# EAGLE schematic psas_c3 (EAGLE 7.3.0)
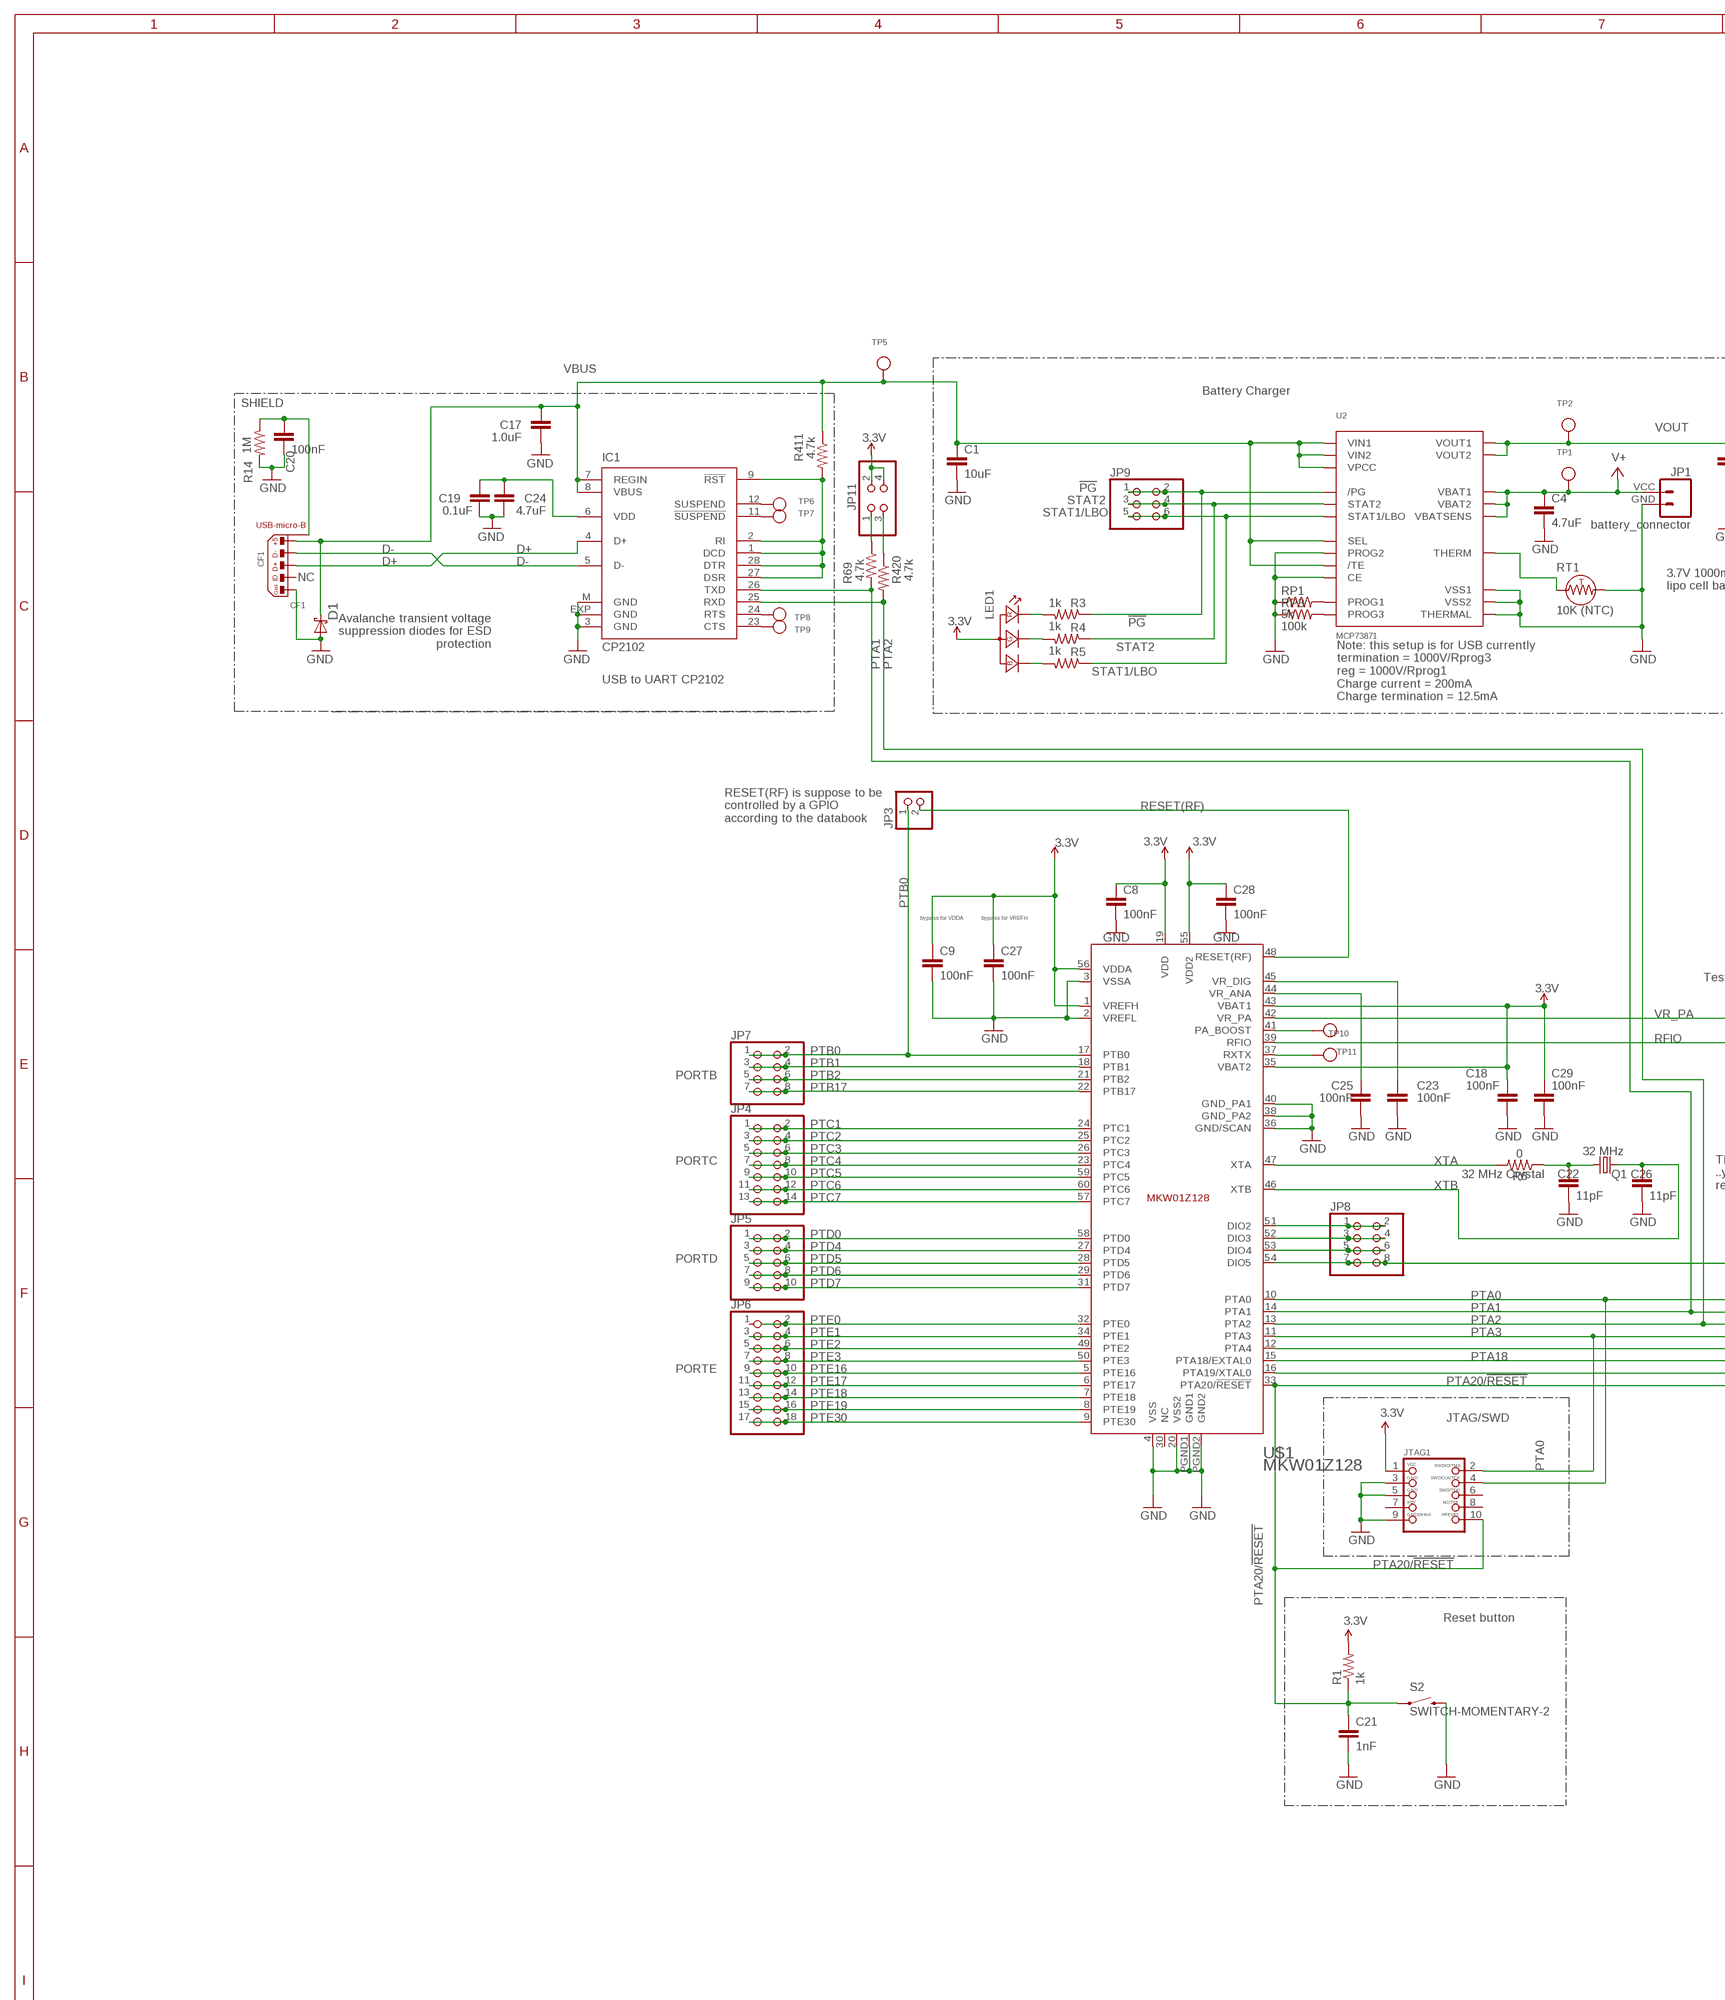
[diagram p0: schematic, sheet 1, part 1 of 2]
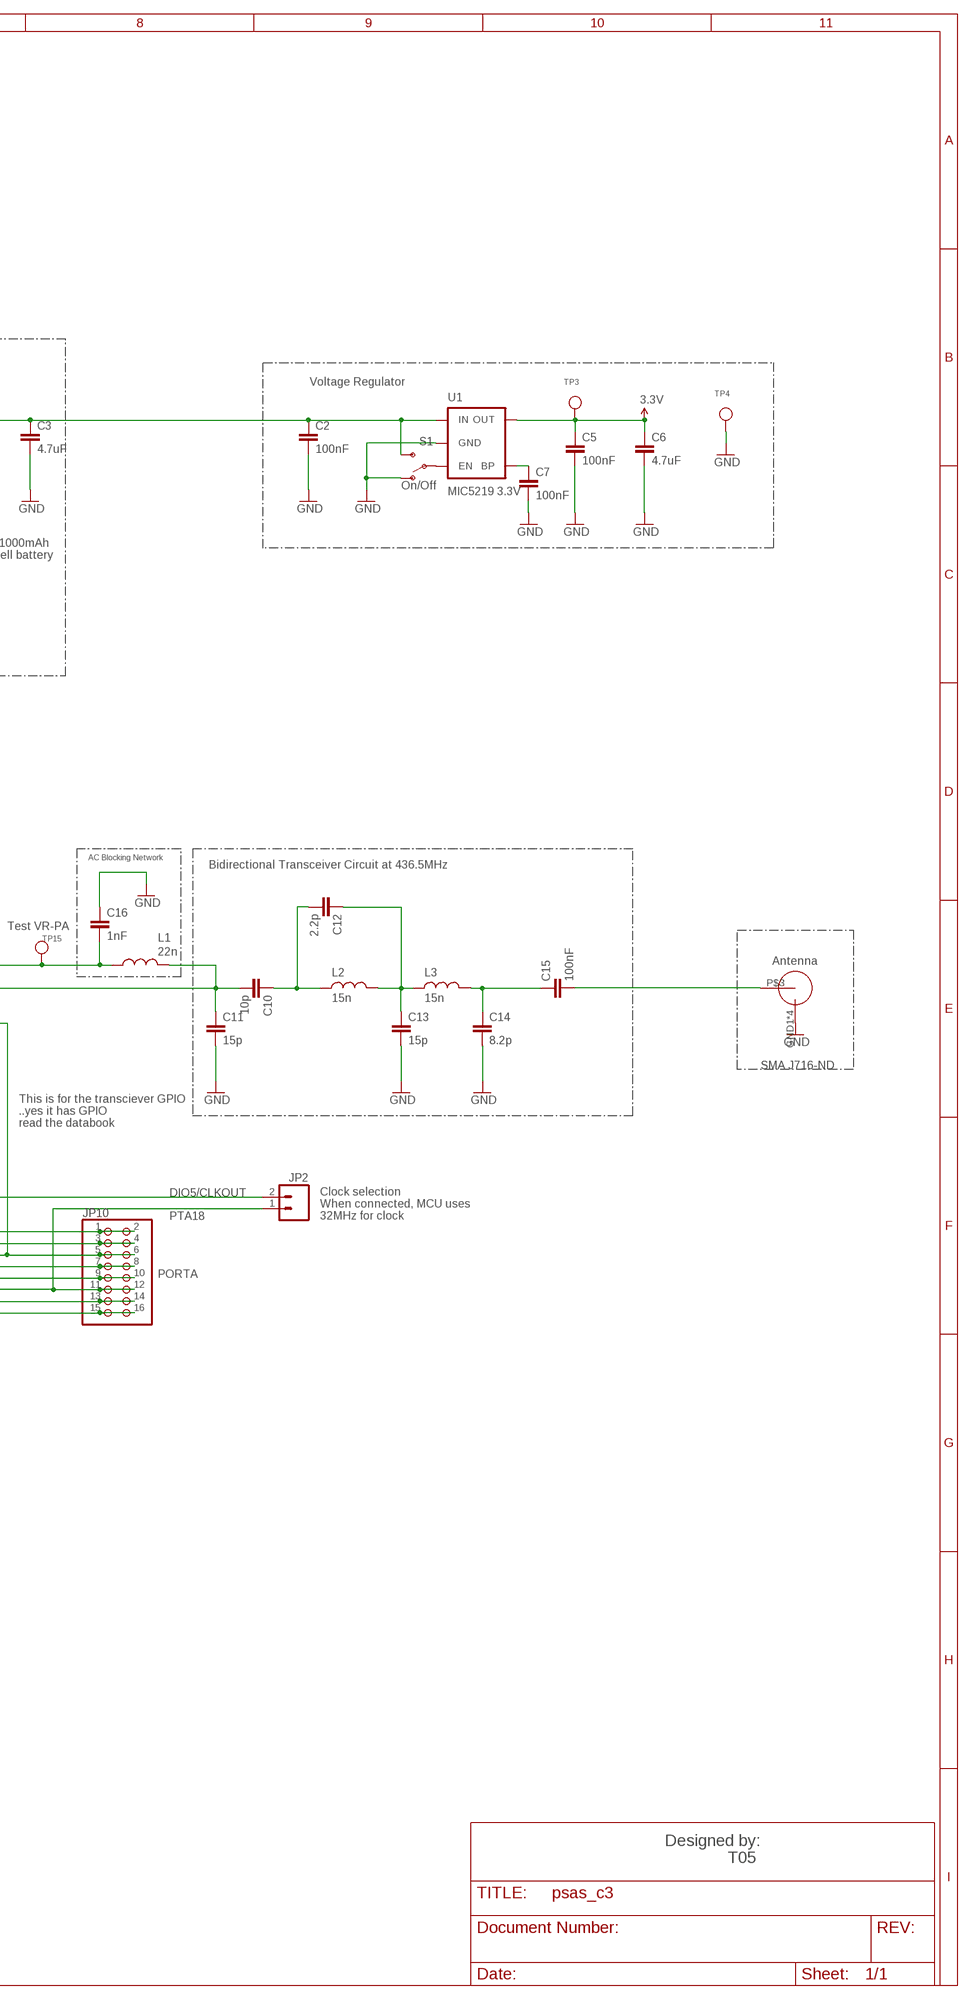
[diagram p1: schematic, sheet 1, part 2 of 2]

## Parts
C1  10uF  C-EU0603-B-NOSILK  [.0603-B-NOSILK]
C2  100nF  C-EU0603-B-NOSILK  [.0603-B-NOSILK]
C3  4.7uF  C-EU0603-B-NOSILK  [.0603-B-NOSILK]
C4  4.7uF  C-EU0603-B-NOSILK  [.0603-B-NOSILK]
C5  100nF  C-EU0603-B-NOSILK  [.0603-B-NOSILK]
C6  4.7uF  C-EU0603-B-NOSILK  [.0603-B-NOSILK]
C7  100nF  C-EU0603-B-NOSILK  [.0603-B-NOSILK]
C8  100nF  C-EU0603-B-NOSILK  [.0603-B-NOSILK]
C9  100nF  C-EU0603-B-NOSILK  [.0603-B-NOSILK]
C10  10p  C-EU0603-B-NOSILK  [.0603-B-NOSILK]
C11  15p  C-EU0603-B-NOSILK  [.0603-B-NOSILK]
C12  2.2p  C-EU0603-B-NOSILK  [.0603-B-NOSILK]
C13  15p  C-EU0603-B-NOSILK  [.0603-B-NOSILK]
C14  8.2p  C-EU0603-B-NOSILK  [.0603-B-NOSILK]
C15  100nF  C-EU0603-B-NOSILK  [.0603-B-NOSILK]
C16  1nF  C-EU0603-B-NOSILK  [.0603-B-NOSILK]
C17  1.0uF  C-EU0603-B-NOSILK  [.0603-B-NOSILK]
C18  100nF  C-EU0603-B-NOSILK  [.0603-B-NOSILK]
C19  0.1uF  C-EU0603-B-NOSILK  [.0603-B-NOSILK]
C20  100nF  C-EU0603-B-NOSILK  [.0603-B-NOSILK]
C21  1nF  C-EU0603-B-NOSILK  [.0603-B-NOSILK]
C22  11pF  C-EU0603-B-NOSILK  [.0603-B-NOSILK]
C23  100nF  C-EU0603-B-NOSILK  [.0603-B-NOSILK]
C24  4.7uF  C-EU0603-B-NOSILK  [.0603-B-NOSILK]
C25  100nF  C-EU0603-B-NOSILK  [.0603-B-NOSILK]
C26  11pF  C-EU0603-B-NOSILK  [.0603-B-NOSILK]
C27  100nF  C-EU0603-B-NOSILK  [.0603-B-NOSILK]
C28  100nF  C-EU0603-B-NOSILK  [.0603-B-NOSILK]
C29  100nF  C-EU0603-B-NOSILK  [.0603-B-NOSILK]
CF1  CF1  CON_USB-MICRO-B-RECEPTACLE-PTH-HIROSE-ZX62D-B-5P8  [USB-MICRO-B-PTH-HIROSE]
D1  DIODE_SCHOTTKY_1N5819  [SOD-123]
IC1  CP2102  [MLP28]
JP1  battery_connector  SPARKFUN-CONNECTORS_M024UCON-15767  [SPARKFUN-CONNECTORS_JST-2-SMD-VERT]
JP2  M02PTH  [1X02]
JP3  PINHD-1X2  [1X02]
JP4  PINHD-2X7  [2X07]
JP5  PINHD-2X5  [2X05]
JP6  PINHD-2X9  [2X09]
JP7  PINHD-2X4  [2X04]
JP8  PINHD-2X4  [2X04]
JP9  PINHD-2X3  [2X03]
JP10  PINHD-2X8  [2X08]
JP11  PINHD-2X2  [2X02]
JTAG1  JTAG-CORTEXM3MOLEX  [CORTEXM3_SWD10_MOLEX]
L1  22n  L-US0603-B-NOSILK  [.0603-B-NOSILK]
L2  15n  L-US0603-B-NOSILK  [.0603-B-NOSILK]
L3  15n  L-US0603-B-NOSILK  [.0603-B-NOSILK]
LED1  LED_RGB_COMMON_ANODE-1.6X1.26  [KINGBRITE_RGBLED_1.6X1.26]
Q1  32 MHz  FC-12M  [FC-12M]
R1  1k  R-US_0603-B-NOSILK  [.0603-B-NOSILK]
R3  1k  R-US_0603-B-NOSILK  [.0603-B-NOSILK]
R4  1k  R-US_0603-B-NOSILK  [.0603-B-NOSILK]
R5  1k  R-US_0603-B-NOSILK  [.0603-B-NOSILK]
R6  0  R-US_0603-B-NOSILK  [.0603-B-NOSILK]
R14  1M  R-US_0603-B-NOSILK  [.0603-B-NOSILK]
R69  4.7k  R-US_0603-B-NOSILK  [.0603-B-NOSILK]
R411  4.7k  R-US_0603-B-NOSILK  [.0603-B-NOSILK]
R420  4.7k  R-US_0603-B-NOSILK  [.0603-B-NOSILK]
RP1  5k  R-US_0603-B-NOSILK  [.0603-B-NOSILK]
RP3  100k  R-US_0603-B-NOSILK  [.0603-B-NOSILK]
RT1  10K (NTC)  THERMISTOR-_1206  [R1206]
S1  SWITCH-SPSTPTH  [SWITCH-SPDT]
S2  SWITCH-MOMENTARY-2  [TACTILE_SWITCH_TALL]
TP1  TESTPOINTROUND0.5MM  [TESTPOINT_ROUND_0.5MM]
TP2  TESTPOINTROUND0.5MM  [TESTPOINT_ROUND_0.5MM]
TP3  TESTPOINTROUND0.5MM  [TESTPOINT_ROUND_0.5MM]
TP4  TESTPOINTROUND0.5MM  [TESTPOINT_ROUND_0.5MM]
TP5  TESTPOINTROUND0.5MM  [TESTPOINT_ROUND_0.5MM]
TP6  TESTPOINTROUND0.5MM  [TESTPOINT_ROUND_0.5MM]
TP7  TESTPOINTROUND0.5MM  [TESTPOINT_ROUND_0.5MM]
TP8  TESTPOINTROUND0.5MM  [TESTPOINT_ROUND_0.5MM]
TP9  TESTPOINTROUND0.5MM  [TESTPOINT_ROUND_0.5MM]
TP10  TESTPOINTROUND0.5MM  [TESTPOINT_ROUND_0.5MM]
TP11  TESTPOINTROUND0.5MM  [TESTPOINT_ROUND_0.5MM]
TP15  TESTPOINTROUND0.5MM  [TESTPOINT_ROUND_0.5MM]
U1  MIC5219 3.3V  SPARKFUN-POWERIC_V_REG_MIC52193.3V  [SPARKFUN-POWERIC_SOT23-5]
U2  MCP73871  [QFN20_4MM]
U$1  MKW01Z128  [MKW01Z128]
U$2  SMAJ716-ND  [SMAJ716-ND]

## Nets
3.3V: C5.1 C6.1 C8.1 C9.1 C18.1 C27.1 C28.1 C29.1 JP11.2 JP11.4 JTAG1.1 LED1.2(COMMON_ANODE) R1.2 TP3.P$1 U1.5(OUT) U$1.1(VREFH) U$1.19(VDD) U$1.35(VBAT2) U$1.43(VBAT1) U$1.55(VDD2) U$1.56(VDDA)
!PG: JP9.1 JP9.2 R3.1 U2.P$6(/PG)
D+: CF1.3 IC1.4(D+)
D-: CF1.2 IC1.5(D-)
DIO5/CLKOUT: JP2.2 JP8.7 JP8.8 U$1.54(DIO5)
GND: C1.2 C2.2 C3.2 C4.2 C5.2 C6.2 C7.2 C8.2 C9.2 C11.2 C13.2 C14.2 C16.1 C17.2 C18.2 C19.2 C20.2 C21.2 C22.2 C23.2 C24.2 C25.2 C26.2 C27.2 C28.2 C29.2 CF1.5 D1.ANODE IC1.3(GND) IC1.EXP(GND) IC1.M(GND) JP1.GND JTAG1.3 JTAG1.5 JTAG1.9 R14.2 RP1.1 RP3.1 RT1.2 S1.1(O) S2.B2 TP4.P$1 U1.2(GND) U2.P$4(PROG2) U2.P$10(VSS1) U2.P$11(VSS2) U2.P$17(CE) U2.P$21(THERMAL) U$1.2(VREFL) U$1.3(VSSA) U$1.4(VSS) U$1.20(VSS2) U$1.36(GND/SCAN) U$1.38(GND_PA2) U$1.40(GND_PA1) U$1.PGND1(GND1) U$1.PGND2(GND2) U$2.GND1(OUTERCONDUCTOR) U$2.GND2(OUTERCONDUCTOR) U$2.GND3(OUTERCONDUCTOR) U$2.GND4(OUTERCONDUCTOR)
N$1: C7.1 U1.4(BP)
N$2: LED1.3(RK) R3.2
N$3: LED1.4(GK) R4.2
N$4: LED1.1(BK) R5.2
N$5: IC1.12(SUSPEND) TP6.P$1
N$6: RT1.1 U2.P$5(THERM)
N$7: IC1.11(!SUSPEND) TP7.P$1
N$8: S1.2(P) U1.3(EN)
N$9: RP1.2 U2.P$13(PROG1)
N$10: RP3.2 U2.P$12(PROG3)
N$11: IC1.24(RTS) TP8.P$1
N$12: C22.1 Q1.2 R6.1
N$13: TP10.P$1 U$1.41(PA_BOOST)
N$14: C25.1 U$1.44(VR_ANA)
N$15: TP11.P$1 U$1.37(RXTX)
N$16: JP8.1 JP8.2 U$1.51(DIO2)
N$17: C12.1 C13.1 L2.2 L3.1
N$18: C10.1 C12.2 L2.1
N$19: C15.2 U$2.P$3(CENTERCONDUCTOR)
N$20: JP8.3 JP8.4 U$1.52(DIO3)
N$21: C14.1 C15.1 L3.2
N$22: C23.1 U$1.45(VR_DIG)
N$23: JP8.5 JP8.6 U$1.53(DIO4)
N$24: C19.1 C24.1 IC1.6(VDD)
N$25: IC1.23(CTS) TP9.P$1
N$26: JP10.9 JP10.10 U$1.12(PTA4)
N$27: JP10.13 JP10.14 U$1.16(PTA19/XTAL0)
N$28: JP11.1 R69.1
N$29: JP11.3 R420.1
N$30: IC1.1(DCD) IC1.2(RI) IC1.9(!RST) IC1.27(DSR) IC1.28(DTR) R411.2
N$34: C20.1 CF1.S1(SHIELD) CF1.S2(SHIELD) CF1.S3(SHIELD) CF1.S4(SHIELD) R14.1
PTA0: JP10.1 JP10.2 JTAG1.4 U$1.10(PTA0)
PTA1: IC1.26(TXD) JP10.3 JP10.4 R69.2 U$1.14(PTA1)
PTA2: IC1.25(RXD) JP10.5 JP10.6 R420.2 U$1.13(PTA2)
PTA3: JP10.7 JP10.8 JTAG1.2 U$1.11(PTA3)
PTA18: JP2.1 JP10.11 JP10.12 U$1.15(PTA18/EXTAL0)
PTA20/!RESET: C21.1 JP10.15 JP10.16 JTAG1.10 R1.1 S2.A2 U$1.33(PTA20/!RESET)
PTB0: JP3.1 JP7.1 JP7.2 U$1.17(PTB0)
PTB1: JP7.3 JP7.4 U$1.18(PTB1)
PTB2: JP7.5 JP7.6 U$1.21(PTB2)
PTB17: JP7.7 JP7.8 U$1.22(PTB17)
PTC1: JP4.1 JP4.2 U$1.24(PTC1)
PTC2: JP4.3 JP4.4 U$1.25(PTC2)
PTC3: JP4.5 JP4.6 U$1.26(PTC3)
PTC4: JP4.7 JP4.8 U$1.23(PTC4)
PTC5: JP4.9 JP4.10 U$1.59(PTC5)
PTC6: JP4.11 JP4.12 U$1.60(PTC6)
PTC7: JP4.13 JP4.14 U$1.57(PTC7)
PTD0: JP5.1 JP5.2 U$1.58(PTD0)
PTD4: JP5.3 JP5.4 U$1.27(PTD4)
PTD5: JP5.5 JP5.6 U$1.28(PTD5)
PTD6: JP5.7 JP5.8 U$1.29(PTD6)
PTD7: JP5.9 JP5.10 U$1.31(PTD7)
PTE0: JP6.2 U$1.32(PTE0)
PTE1: JP6.3 JP6.4 U$1.34(PTE1)
PTE2: JP6.5 JP6.6 U$1.49(PTE2)
PTE3: JP6.7 JP6.8 U$1.50(PTE3)
PTE16: JP6.9 JP6.10 U$1.5(PTE16)
PTE17: JP6.11 JP6.12 U$1.6(PTE17)
PTE18: JP6.13 JP6.14 U$1.7(PTE18)
PTE19: JP6.15 JP6.16 U$1.8(PTE19)
PTE30: JP6.17 JP6.18 U$1.9(PTE30)
RESET(RF): JP3.2 U$1.48(RESET(RF))
RFIO: C10.2 C11.1 L1.2 U$1.39(RFIO)
STAT1/LBO: JP9.5 JP9.6 R5.1 U2.P$8(STAT1/LBO)
STAT2: JP9.3 JP9.4 R4.1 U2.P$7(STAT2)
V+: C4.1 JP1.VCC TP1.P$1 U2.P$14(VBAT1) U2.P$15(VBAT2) U2.P$16(VBATSENS)
VBUS: C1.1 C17.1 CF1.1 D1.CATHODE IC1.7(REGIN) IC1.8(VBUS) R411.1 TP5.P$1 U2.P$2(VPCC) U2.P$3(SEL) U2.P$9(/TE) U2.P$18(VIN1) U2.P$19(VIN2)
VOUT: C2.1 C3.1 S1.3(S) TP2.P$1 U1.1(IN) U2.P$1(VOUT1) U2.P$20(VOUT2)
VR_PA: C16.2 L1.1 TP15.P$1 U$1.42(VR_PA)
XTA: R6.2 U$1.47(XTA)
XTB: C26.1 Q1.1 U$1.46(XTB)
Unconnected: CF1.4 JP6.1 JTAG1.6 JTAG1.7 JTAG1.8 U$1.30(NC)

## Notes on the sheet
- VBUS
- Battery Charger
- SHIELD | Voltage Regulator
- On/Off
- NC
- 3.7V 1000mAh
  lipo cell battery
- Avalanche transient voltage
  suppression diodes for ESD
  protection
- USB to UART CP2102
- Note: this setup is for USB currently
  termination = 1000V/Rprog3
  reg = 1000V/Rprog1
  Charge current = 200mA
  Charge termination = 12.5mA
- RESET(RF) is suppose to be
  controlled by a GPIO
  according to the databook
- AC Blocking Network | Bidirectional Transceiver Circuit at 436.5MHz
- bypass for VDDA | bypass for VREFH
- Test VR-PA
- Antenna
- PORTB
- SMA J716-ND
- PORTC
- 32 MHz Crystal
- This is for the transciever GPIO
  ..yes it has GPIO
  read the databook
- PORTD
- Clock selection
  When connected, MCU uses
  32MHz for clock
- PORTA
- PORTE
- JTAG/SWD
- Reset button
- Designed by:
  T05

## Library data of the parts
C1-C7 C10-C17 C19-C21 C24 = rcl_custom:C-EU: CAPACITOR, European symbol
C8 C9 C18 C22 C23 C25-C29 = Vibrogait_prototype:C-EU: CAPACITOR, European symbol; DIST: Digi-Key; DPN: 490-1532-1-ND; MFG: Murata Electronics North America; MPN: GRM188R71C104KA01D
CF1 = Vibrogait_prototype:CON_USB-MICRO-B-RECEPTACLE-*: Standard USB Micro-B receptacle
D1 = Vibrogait_prototype:DIODE_SCHOTTKY_1N5819: Schottky Diode, Reverse Bias Voltage = 40V, Forward Voltage (10mA) = 200mV, SOD-123 Package, 1A forward current, Diodes Inc., Digikey No. 1N5819HW-FDITR-ND
IC1 = silabs:CP210*: Single-Chip USB to UART Bridge Source: www.silabs.com .. CP2101.pdf / cp2102.pdf; MF: FARNELL; MPN: CP2102-GM; OC_FARNELL: 9282130; OC_NEWARK: 30K5635
JP1 = Vibrogait_prototype:SPARKFUN-CONNECTORS_M02: Standard 2-pin 0.1" header. Use with - straight break away headers ( PRT-00116) - right angle break away headers (PRT-00553) - swiss pins (PRT-00743) - machine pins (PRT-00117) - female headers (PRT-00115) Molex polarized connector foot print use with: PRT-08233 with associated crimp pins and housings. 2.54_SCREWTERM for use with PRT-10571. 3.5mm Screw Terminal footprints for PRT-08084 5mm Screw Terminal footprints for use with PRT-08433
JP2 = SparkFun-v5:M02: Header 2 Standard 2-pin 0.1" header. Use with straight break away headers (SKU : PRT-00116), right angle break away headers (PRT-00553), swiss pins (PRT-00743), machine pins (PRT-00117), and female headers (PRT-00115). Molex polarized connector foot print use with SKU : PRT-08233 with associated crimp pins and housings.
JP3 = pinhead:PINHD-1X2: PIN HEADER
JP4 = pinhead:PINHD-2X7: PIN HEADER
JP5 = pinhead:PINHD-2X5: PIN HEADER
JP6 = pinhead:PINHD-2X9: PIN HEADER
JP7 JP8 = pinhead:PINHD-2X4: PIN HEADER
JP9 = pinhead:PINHD-2X3: PIN HEADER
JP10 = pinhead:PINHD-2X8: PIN HEADER
JP11 = pinhead:PINHD-2X2: PIN HEADER
JTAG1 = microbuilder:JTAG-CORTEXM3: Serial Wire (SW-DP) Connector This standard 0.05" 10-pin connector is for use with the Cortex M0/M3's native SWD (serial wire debugger) interface (SW-DP). Some boards support a 20-pin combined JTAG+SWD connector (SWJ-DP), such as the LPC1700 family, but many smaller devices only work with SWD which typically use the smaller 10-pin SW-DP connecter (the LPC1300 family, for example, only supports SWD). 2x05 1.27mm/0.05" Connector: This is the standard SMT connector defined by ARM for all Cortex devices, and should be used in most situations and for forward-compatibility since any new devices coming to market will likely use this connector. MOLEX 10 Pin 0.1" Connector: This 0.1" 10 pin connector has the same pin layout as the standard 0.05" connector, but is easier to work with if you are using standard jumper wires or custom cables to connect your SWD hardware. MOLEX 20 Pin 0.1" Connector: This 0.1" 20 pin connector is the same model used for ARM7/ARM9 JTAG debuggers, but is connected to match the pins on the Segger J-Link for ARM (which supports both JTAG and SWD debugging). See the following document from ARM for more information on Cortex M3 Debug Connectors: http://infocenter.arm.com/help/topic/com.arm.doc.faqs/attached/13634/cortex_debug_connectors.pdf And the following page for an overview with images of the different connector types: http://www.keil.com/peripherals/coresight/connectors.asp
L1-L3 = rcl_custom:L-US: INDUCTOR, American symbol
LED1 = Vibrogait_prototype:LED_RGB_COMMON_ANODE-*: RGB LED with comon anode
Q1 = crystal:FC-12M: kHz RANGE CRYSTAL UNIT LOW PROFILE SMD Source: Epson Toyocom FC-12M.pdf
R1 R3-R6 R14 R69 R411 R420 RP1 RP3 = rcl_custom:R-US_: RESISTOR, American symbol
RT1 = Vibrogait_prototype:THERMISTOR-: Thermistor
S1 = Vibrogait_prototype:SWITCH-SPST: SPST Switch Simple slide switch. Spark Fun Electronics SKU : COM-00102
S2 = Vibrogait_prototype:SWITCH-MOMENTARY-2
TP1-TP11 TP15 = microbuilder:TESTPOINT: Test Point Various test points for characterisation and PCB testing TESTPOINT_SMT - Compact Surface Mount Test Point [Digikey: 5016KTR-ND]
U1 = Vibrogait_prototype:SPARKFUN-POWERIC_V_REG_MIC5219: V_REG MIC5219 Standard 3.3V and 5V 500mA LDO voltage regulator in SOT-23 layout. Micrel part MIC5219. BP (by-pass) pin is used to lower output noise with 470pF cap, may be left open.; PROD_ID: VREG-09872
U2 = microbuilder:MCP73871: MCP73871 Lithium Polymer Battery Charger Digikey: MCP73871-2CCI/ML-ND
U$1 = psas_c3:MKW01Z128; DIST: Digi-Key; DPN: MKW01Z128CHN-ND; MFN: Freescale Semiconductor; MPN: MKW01Z128CHN
U$2 = SMAJ16-ND:SMAJ716-ND